# EAGLE design Gyrocam Servo Driver STM32G070KBT6 (EAGLE 9.6.2)
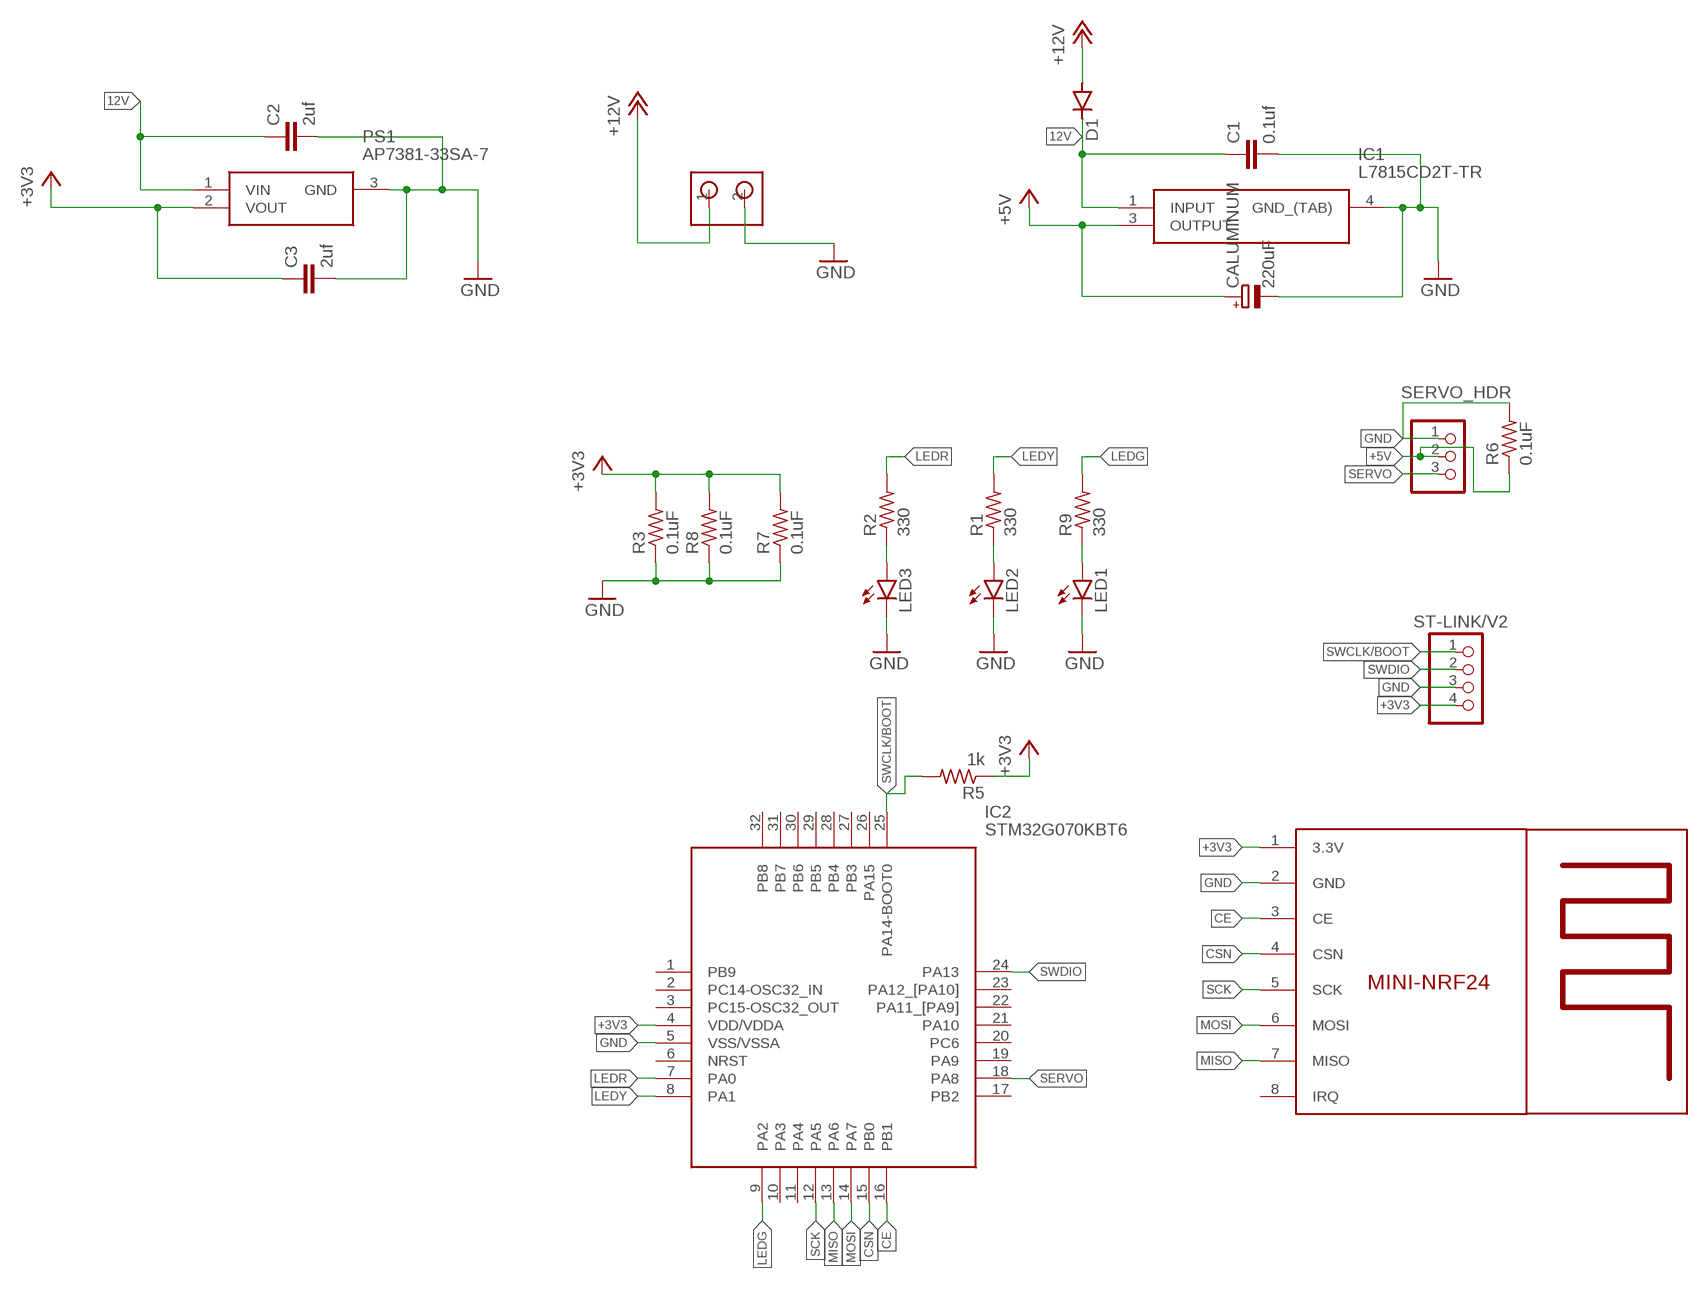
[diagram p0: schematic, sheet 1]

## Parts
C1  0.1uf  C-EUC0805K  [C0805K]
C2  2uf  C-EUC0805K  [C0805K]
C3  2uf  C-EUC0805K  [C0805K]
CALUMINUM  220uF  CPOL-EU153CLV-0810  [153CLV-0810]
D1  DIODE-DO-214AC  [DO-214AC]
IC1  L7815CD2T-TR  [TO254P1542X460-3N]
IC2  STM32G070KBT6  [QFP80P900X900X160-32N]
LED1  LEDSML0805  [SML0805]
LED2  LEDSML0805  [SML0805]
LED3  LEDSML0805  [SML0805]
PS1  AP7381-33SA-7  [SOT96P240X120-3N]
R1  330  R-US_R0805  [R0805]
R2  330  R-US_R0805  [R0805]
R3  0.1uF  R-US_R0805  [R0805]
R5  1k  R-US_R0805  [R0805]
R6  0.1uF  R-US_R0805  [R0805]
R7  0.1uF  R-US_R0805  [R0805]
R8  0.1uF  R-US_R0805  [R0805]
R9  330  R-US_R0805  [R0805]
SERVO_HDR  PINHD-1X3  [1X03]
ST-LINK/V2  PINHD-1X4  [1X04]
U$2  MINI-NRF24L01PSMD  [NRF24L01_SMD]
U$5  PINHEAD2_18AAWG  [PINHEAD2_18AWG]

## Nets
12V: C1.1 C2.1 D1.C IC1.1(INPUT) PS1.1(VIN)
+3V3: C3.1 IC2.4(VDD/VDDA) PS1.2(VOUT) R3.2 R5.1 R7.2 R8.2 ST-LINK/V2.4 U$2.1(3.3V)
+5V: CALUMINUM.+ IC1.3(OUTPUT) R6.1 SERVO_HDR.2
+12V: D1.A U$5.1
CE: IC2.16(PB1) U$2.3(CE)
CSN: IC2.15(PB0) U$2.4(CSN)
GND: C1.2 C2.2 C3.2 CALUMINUM.- IC1.4(GND_(TAB)) IC2.5(VSS/VSSA) LED1.C LED2.C LED3.C PS1.3(GND) R3.1 R6.2 R7.1 R8.1 SERVO_HDR.1 ST-LINK/V2.3 U$2.2(GND) U$5.2
LEDG: IC2.9(PA2) R9.2
LEDR: IC2.7(PA0) R2.2
LEDY: IC2.8(PA1) R1.2
MISO: IC2.13(PA6) U$2.7(MISO)
MOSI: IC2.14(PA7) U$2.6(MOSI)
N$1: LED2.A R1.1
N$2: LED3.A R2.1
N$3: LED1.A R9.1
SCK: IC2.12(PA5) U$2.5(SCK)
SERVO: IC2.18(PA8) SERVO_HDR.3
SWCLK/BOOT: IC2.25(PA14-BOOT0) R5.2 ST-LINK/V2.1
SWDIO: IC2.24(PA13) ST-LINK/V2.2
Unconnected: IC2.1(PB9) IC2.2(PC14-OSC32_IN) IC2.3(PC15-OSC32_OUT) IC2.6(NRST) IC2.10(PA3) IC2.11(PA4) IC2.17(PB2) IC2.19(PA9) IC2.20(PC6) IC2.21(PA10) IC2.22(PA11_[PA9]) IC2.23(PA12_[PA10]) IC2.26(PA15) IC2.27(PB3) IC2.28(PB4) IC2.29(PB5) IC2.30(PB6) IC2.31(PB7) IC2.32(PB8) U$2.8(IRQ)

## Library data of the parts
C1-C3 = rcl:C-EU: CAPACITOR, European symbol; SPICEPREFIX: C
CALUMINUM = rcl:CPOL-EU: POLARIZED CAPACITOR, European symbol; SPICEPREFIX: C
D1 = diode:DIODE-: DIODE
IC1 = 6voltsL7815CD2T-TR:L7815CD2T-TR: Voltage Regulator 15V 1.5A D2PAK STMicroelectronics L7815CD2T-TR, Single Linear Voltage Regulator, 1.5A 15 V, 3-Pin D2PAK Source: Datasheet <http://www.st.com/web/en/resource/technical/document/datasheet/CD00000444.pdf>; DESCRIPTION: Voltage Regulator 15V 1.5A D2PAK STMicroelectronics L7815CD2T-TR, Single Linear Voltage Regulator, 1.5A 15 V, 3-Pin D2PAK; HEIGHT: 4.6mm; MANUFACTURER_NAME: STMicroelectronics; MANUFACTURER_PART_NUMBER: L7815CD2T-TR; MOUSER_PART_NUMBER: 511-L7815CD2T-TR; MOUSER_PRICE-STOCK: https://www.mouser.co.uk/ProductDetail/STMicroelectronics/L7815CD2T-TR?qs=UnsPL7ngM55qtUyn38JDrw%3D%3D
IC2 = mouser-STM32G070KBT6:STM32G070KBT6: 32-bit Microcontrollers - MCU Arm Cortex -M0+ 32-bit MCU, 128 KB Flash, 36 KB RAM, 4x USART, timers, ADC, comm. I/Fs, 2.0-3.6V Source: Datasheet; DESCRIPTION: 32-bit Microcontrollers - MCU Arm Cortex -M0+ 32-bit MCU, 128 KB Flash, 36 KB RAM, 4x USART, timers, ADC, comm. I/Fs, 2.0-3.6V; HEIGHT: 1.6mm; MANUFACTURER_NAME: STMicroelectronics; MANUFACTURER_PART_NUMBER: STM32G070KBT6; MOUSER_PART_NUMBER: 511-STM32G070KBT6; MOUSER_PRICE-STOCK: https://www.mouser.co.uk/ProductDetail/STMicroelectronics/STM32G070KBT6?qs=l7cgNqFNU1hmGcXjKEot4A%3D%3D
LED1-LED3 = led:LED: LED OSRAM: - CHIPLED LG R971, LG N971, LY N971, LG Q971, LY Q971, LO R971, LY R971 LH N974, LH R974 LS Q976, LO Q976, LY Q976 LO Q996 - Hyper CHIPLED LW Q18S LB Q993, LB Q99A, LB R99A - SideLED LS A670, LO A670, LY A670, LG A670, LP A670 LB A673, LV A673, LT A673, LW A673 LH A674 LY A675 LS A676, LA A676, LO A676, LY A676, LW A676 LS A679, LY A679, LG A679 - Hyper Micro SIDELED® LS Y876, LA Y876, LO Y876, LY Y876 LT Y87S - SmartLED LW L88C, LW L88S LB L89C, LB L89S, LG L890 LS L89K, LO L89K, LY L89K LS L896, LA L896, LO L896, LY L896 - TOPLED LS T670, LO T670, LY T670, LG T670, LP T670 LSG T670, LSP T670, LSY T670, LOP T670, LYG T670 LG T671, LOG T671, LSG T671 LB T673, LV T673, LT T673, LW T673 LH T674 LS T676, LA T676, LO T676, LY T676, LB T676, LH T676, LSB T676, LW T676 LB T67C, LV T67C, LT T67C, LS T67K, LO T67K, LY T67K, LW E67C LS E67B, LA E67B, LO E67B, LY E67B, LB E67C, LV E67C, LT E67C LW T67C LS T679, LY T679, LG T679 LS T770, LO T770, LY T770, LG T770, LP T770 LB T773, LV T773, LT T773, LW T773 LH T774 LS E675, LA E675, LY E675, LS T675 LS T776, LA T776, LO T776, LY T776, LB T776 LHGB T686 LT T68C, LB T68C - Hyper Mini TOPLED® LB M676 - Mini TOPLED Santana® LG M470 LS M47K, LO M47K, LY M47K Source: http://www.osram.convergy.de LUXEON: - LUMILED® LXK2-PW12-R00, LXK2-PW12-S00, LXK2-PW14-U00, LXK2-PW14-V00 LXK2-PM12-R00, LXK2-PM12-S00, LXK2-PM14-U00 LXK2-PE12-Q00, LXK2-PE12-R00, LXK2-PE12-S00, LXK2-PE14-T00, LXK2-PE14-U00 LXK2-PB12-K00, LXK2-PB12-L00, LXK2-PB12-M00, LXK2-PB14-N00, LXK2-PB14-P00, LXK2-PB14-Q00 LXK2-PR12-L00, LXK2-PR12-M00, LXK2-PR14-Q00, LXK2-PR14-R00 LXK2-PD12-Q00, LXK2-PD12-R00, LXK2-PD12-S00 LXK2-PH12-R00, LXK2-PH12-S00 LXK2-PL12-P00, LXK2-PL12-Q00, LXK2-PL12-R00 Source: www.luxeon.com KINGBRIGHT: KA-3528ASYC Source: www.kingbright.com
PS1 = 3.3v_AP7381-33SA-7:AP7381-33SA-7: LDO CMOS LowCurr SOT23 T&R 3K Source: Datasheet <https://www.diodes.com/assets/Datasheets/AP7381.pdf>; DESCRIPTION: LDO CMOS LowCurr SOT23 T&R 3K; HEIGHT: 1.2mm; MANUFACTURER_NAME: Diodes Inc.; MANUFACTURER_PART_NUMBER: AP7381-33SA-7; MOUSER_PART_NUMBER: 621-AP7381-33SA-7; MOUSER_PRICE-STOCK: https://www.mouser.co.uk/ProductDetail/Diodes-Incorporated/AP7381-33SA-7?qs=y6ZabgHbY%252ByfboEZm%252BnPlA%3D%3D
R1-R3 R5-R9 = rcl:R-US_: RESISTOR, American symbol; SPICEPREFIX: R
SERVO_HDR = pinhead:PINHD-1X3: PIN HEADER
ST-LINK/V2 = pinhead:PINHD-1X4: PIN HEADER
U$2 = Gil:MINI-NRF24L01P
U$5 = Gil:PINHEAD2_18AAWG

## Board
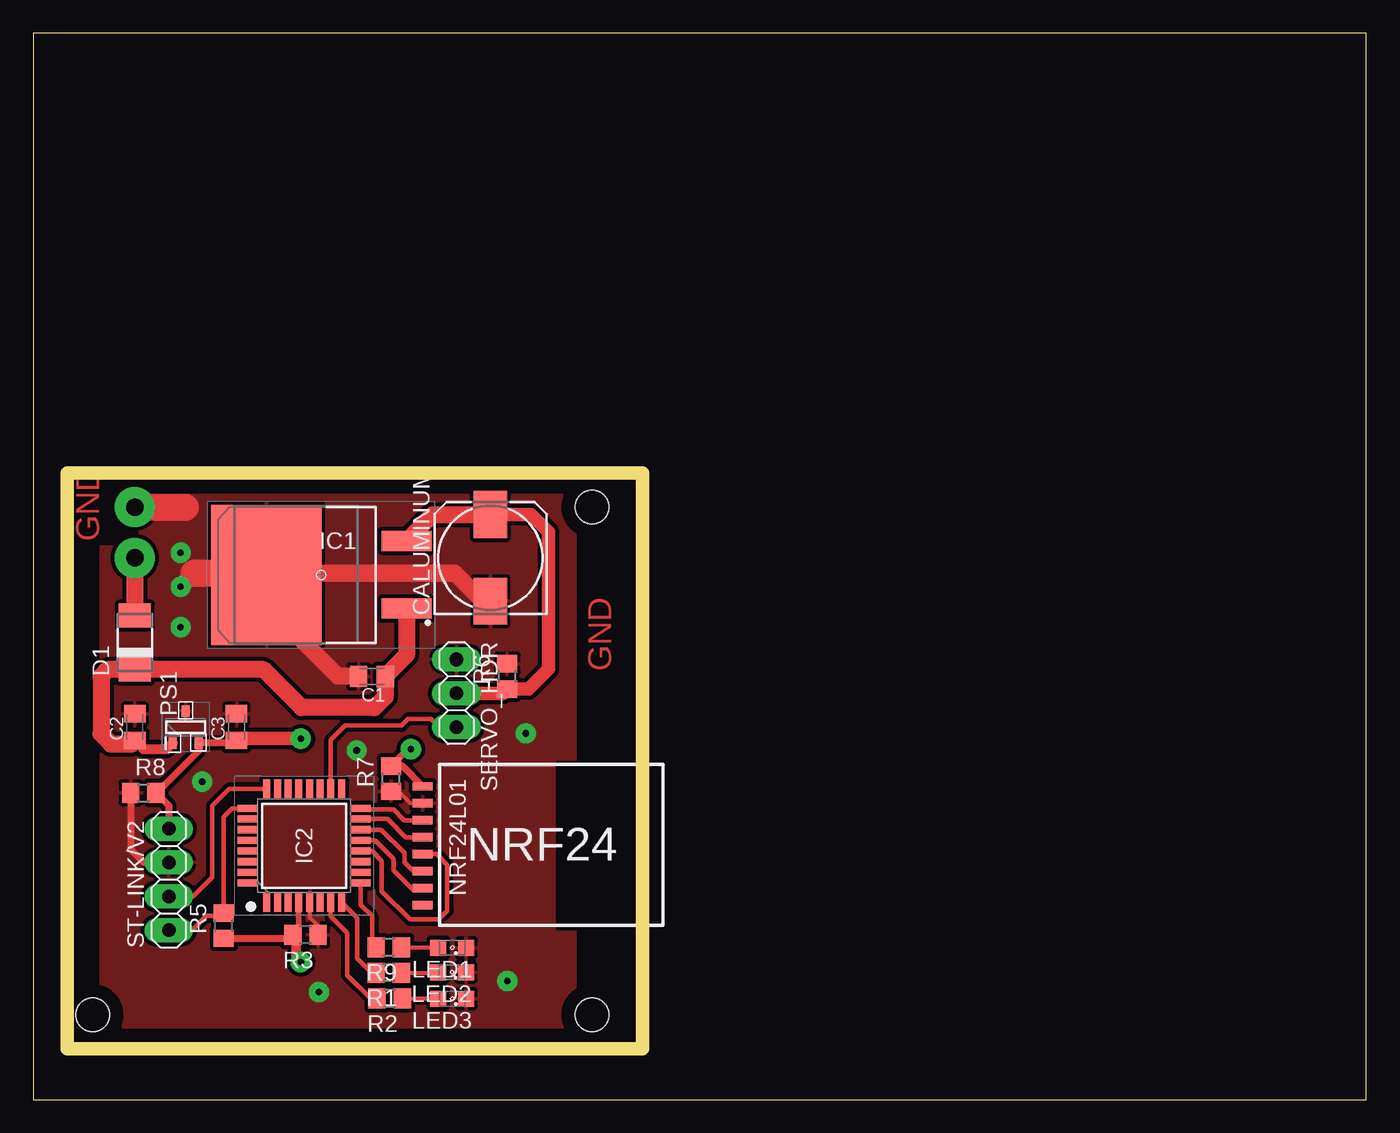
[diagram p1: board, top side]
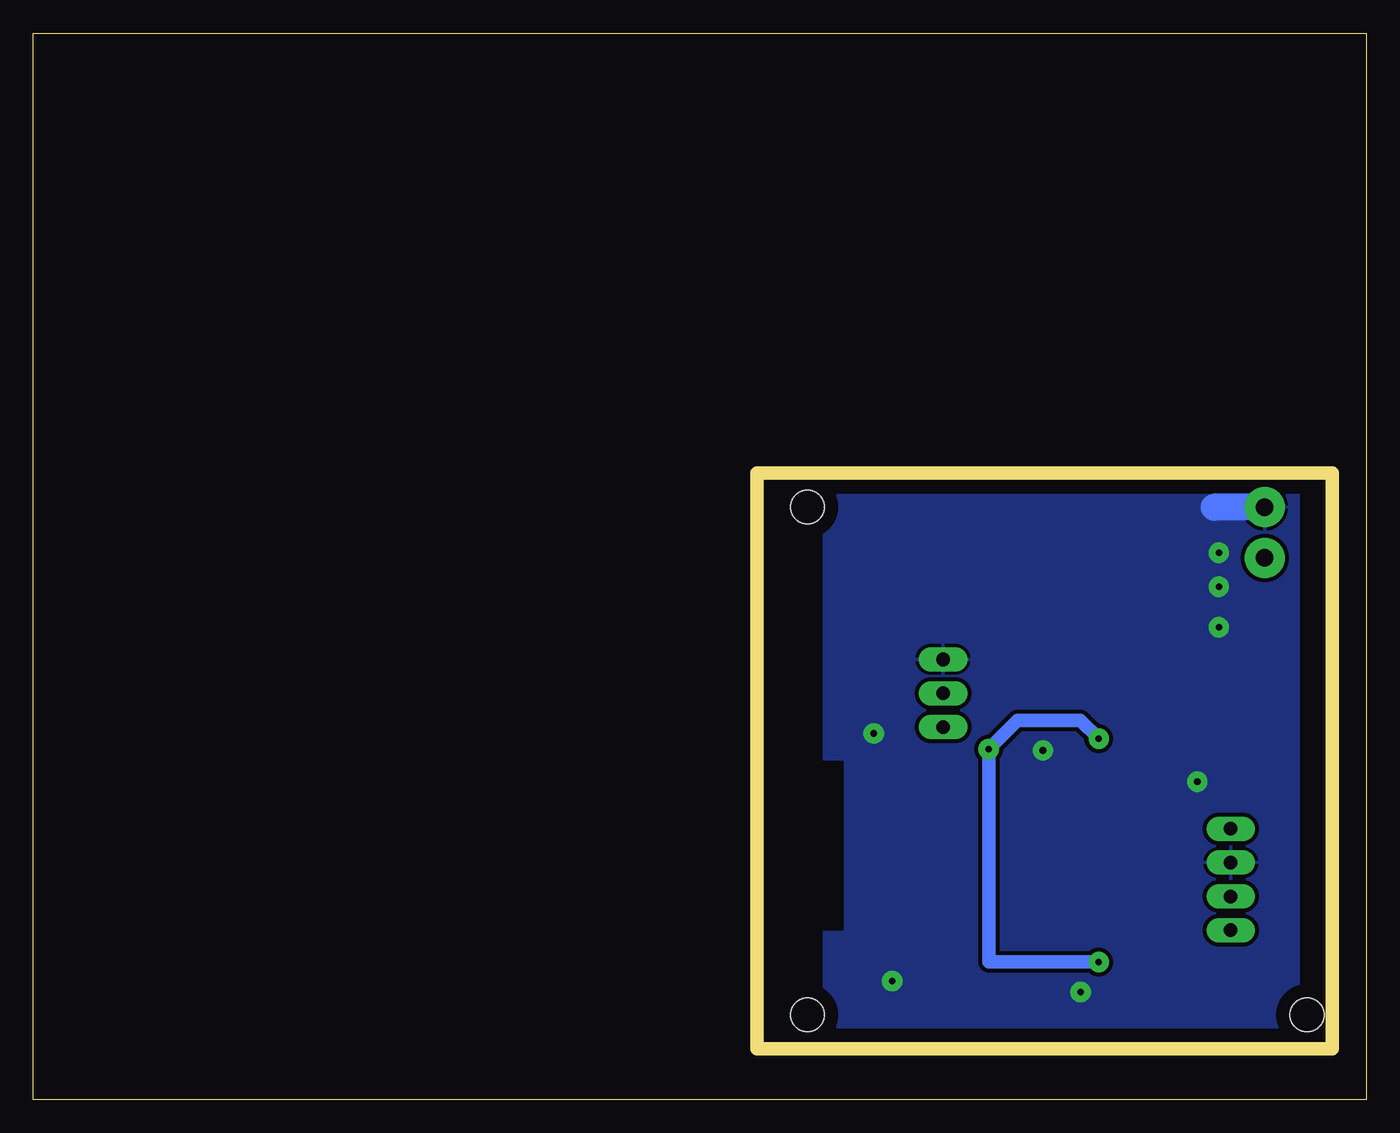
[diagram p2: board, bottom side, seen from below]

Size 100 x 80 mm. Coordinates in mm from the lower left corner, seen from the top.
Outline: 0,0 100,0 100,80 0,80 0,0
Outline: 2.54,46.99 2.54,3.81 45.72,3.81 45.72,46.99 2.54,46.99
Copper layers (1*16): Top 0.035mm / dielectric 1.5mm / Bottom 0.035mm
Design rules "default *": minimum track width 6mil, minimum drill 0.35mm, track to track 12mil, track to pad 12mil, pad to pad 12mil, via to via 12mil, smd to smd 6mil, copper to edge 40mil, drill to drill 6mil, minimum pad ring 16mil, minimum via ring 20mil, stop-mask expansion 4mil, vias tented up to drill 0mil, thermal gap 10mil
Holes 2.54 mm at 41.91,44.45 41.91,6.35 4.45,6.35
Milling: 4 lines

### Footprints (pad centres in the part's own frame; a part is rotated, then mirrored left to right if it is on the bottom)
C0805K = smd 1.3 x 1.6: 1 -1,0; 2 1,0
153CLV-0810 = smd 3.5 x 2.5: + 3.25,0; - -3.25,0
DO-214AC = smd 1.8 x 2.4: A 2.025,0; C -2.025,0
TO254P1542X460-3N = smd 3.75 x 1.5: 1 -6.4,2.54; 3 -6.4,-2.54 | smd 8.3 x 10.5: 4 4.1,0
QFP80P900X900X160-32N = smd 1.475 x 0.533: 1 -4.238,2.8; 2 -4.238,2; 3 -4.238,1.2; 4 -4.238,0.4; 5 -4.238,-0.4; 6 -4.238,-1.2; 7 -4.238,-2; 8 -4.238,-2.8; 17 4.238,-2.8; 18 4.238,-2; 19 4.238,-1.2; 20 4.238,-0.4; 21 4.238,0.4; 22 4.238,1.2; 23 4.238,2; 24 4.238,2.8 | smd 0.533 x 1.475: 9 -2.8,-4.238; 10 -2,-4.238; 11 -1.2,-4.238; 12 -0.4,-4.238; 13 0.4,-4.238; 14 1.2,-4.238; 15 2,-4.238; 16 2.8,-4.238; 25 2.8,4.238; 26 2,4.238; 27 1.2,4.238; 28 0.4,4.238; 29 -0.4,4.238; 30 -1.2,4.238; 31 -2,4.238; 32 -2.8,4.238
SML0805 = smd 1.2 x 1.2: A 1.05,0; C -1.05,0
SOT96P240X120-3N = smd 0.85 x 0.6: 1 -1.2,0.96; 2 -1.2,-0.96; 3 1.2,0
R0805 = smd 1.3 x 1.5: 1 -0.95,0; 2 0.95,0
1X03 = drill 1.016 long: 1 -2.54,0; 2 0,0; 3 2.54,0
1X04 = drill 1.016 long: 1 -3.81,0; 2 -1.27,0; 3 1.27,0; 4 3.81,0
NRF24L01_SMD = smd 1.5 x 0.635: 1 0,4.445; 2 0,3.175; 3 0,1.905; 4 0,0.635; 5 0,-0.635; 6 0,-1.905; 7 0,-3.175; 8 0,-4.445
PINHEAD2_18AWG = drill 1.3 pad 3: 1 0,1.27; 2 0,-2.54

### Placement (x,y rotation side)
C1  25.4,31.75 180 top
C2  7.62,27.94 90 top
C3  15.24,27.94 90 top
CALUMINUM  34.29,40.64 90 top
D1  7.62,34.29 90 top
IC1  21.59,39.37 180 top
IC2  20.32,19.05 90 top
LED1  31.43,11.4 180 top
LED2  31.4,9.56 180 top
LED3  31.43,7.56 180 top
PS1  11.43,27.94 90 top
R1  26.67,9.53 180 top
R2  26.73,7.59 180 top
R3  20.42,12.35 180 top
R5  14.29,13.05 90 top
R6  35.56,31.75 90 top
R7  26.83,24.07 90 top
R8  8.26,23.02 0 top
R9  26.67,11.43 180 top
SERVO_HDR  31.75,30.48 270 top
ST-LINK/V2  10.16,16.51 90 top
U$2  29.21,19.05 0 top
U$5  7.62,41.91 180 top

### Tracks (layer width: path | path; a pad name or v marks a point on that pad's centre or on a via)
12V
  Top 0.762: C2.1 8.27,26.29 10.02,26.29 PS1.1
  Top 1.27: C2.1 7.35,26.67 5.84,26.67 5.08,27.43 5.08,31.75 5.59,32.27 D1.C 17.27,32.27 20.13,29.4 25.59,29.4 26.4,30.21 C1.1 27.99,33.34 IC1.1
+3V3  (via drill 0.5)
  Top 0.305: 19.92,12.81 R3.2
  Top 0.406: IC2.4 19.92,12.81
  Top 0.508: C3.1 15.04,26.74 PS1.2 12.39,26.17 9.85,23.62 R8.2 10.16,22.06 ST-LINK/V2.4 | R3.2 19.46,11.94 19.81,11.59 19.81,10.57 v20.07,10.32 19.59,10.79 19.59,12.1 R5.1 | v28.32,26.29 28.1,26.29 R7.2 27.69,25.02 U$2.1
  Top 1.016: v20.07,27.08 15.38,27.08 C3.1
  Bottom 1.016: v20.07,27.08 21.43,28.45 26.16,28.45 v28.32,26.29 28.32,10.32 v20.07,10.32
+5V
  Top 1.016: CALUMINUM.+ 37.33,43.89 38.64,42.58 38.64,32.29 37.15,30.8 R6.1 35.24,30.48 SERVO_HDR.2
  Top 1.27: IC1.3 29.97,43.89 CALUMINUM.+ 34.85,43.89
+12V
  Top 1.27: U$5.1 D1.A
CE
  Top 0.305: IC2.16 24.65,21.75
  Top 0.356: 24.65,21.75 27.01,21.75 27.81,20.95 U$2.3
CSN
  Top 0.356: IC2.15 26.57,21.05 27.94,19.68 U$2.4
GND  (via drill 0.5, 0.5 pad 1.07)
  Top 0.305: IC2.5 20.72,13.66 21.36,13.02 R3.1 | U$2.2 28.29,22.23 27.4,23.12 R7.1
  Top 0.508: R8.1 7.3,18.76 8.29,17.78 ST-LINK/V2.3
  Top 1.27: v11.05,38.48 12.05,39.48 | C1.2 22.86,31.75 17.49,37.12 IC1.4 17.38,39.48 31.64,39.48 33.73,37.39 CALUMINUM.-
  Top 2.032: 17.38,39.48 12.05,39.48 | U$5.2 11.43,44.45
  Bottom 2.032: U$5.2 11.43,44.45
  other vias: 11.05,35.43 35.56,8.89 24.26,26.19 21.43,8.06 12.67,23.84 11.05,41.02 36.96,27.46
  pour Top: 5.08,45.72 40.64,45.72 40.64,5.08 5.08,5.08
  pour Bottom: 5.08,45.72 40.64,45.72 40.64,5.08 5.08,5.08
LEDG
  Top 0.356: IC2.9 24.56,14.62 25.4,13.78 25.4,11.75 R9.2
LEDR
  Top 0.305: IC2.7 22.4,14.74
  Top 0.356: IC2.7 22.32,13.75 23.56,12.51 23.56,9.34 25.3,7.59 R2.2
LEDY
  Top 0.356: IC2.8 24.29,13.64 24.29,10.6 25.37,9.53 R1.2
MISO
  Top 0.305: U$2.7 29.07,15.73 28.49,15.73
  Top 0.356: IC2.13 25.64,19.45 27.01,18.07 27.01,17.21 28.49,15.73
MOSI
  Top 0.356: IC2.14 26.11,20.25 27.84,18.51 27.84,17.78 28.48,17.14 U$2.6
N$1
  Top 0.305: R1.1 30.32,9.53 LED2.A
N$2
  Top 0.305: R2.1 30.35,7.59 LED3.A
N$3
  Top 0.305: R9.1 30.35,11.43 LED1.A
SCK
  Top 0.305: U$2.5 29.22,18.43
  Top 0.356: IC2.12 25.41,18.65 26.15,17.91 26.15,15.63 28.27,13.51 30.4,13.51 31.05,14.16 31.05,17.62 30.25,18.43 29.22,18.43
SERVO
  Top 0.356: IC2.18 22.32,26.99 23.4,28.07 27.62,28.07 28.13,28.57 29.84,28.57 30.48,27.94 SERVO_HDR.3
SWCLK/BOOT
  Top 0.305: R5.2 14.07,13.78
  Top 0.356: IC2.25 14.93,21.85 14.29,21.21 R5.2 | 14.07,13.78 12.99,13.78 11.91,12.7 ST-LINK/V2.1
SWDIO
  Top 0.356: IC2.24 14.68,23.29 13.43,22.04 13.43,16.67 12,15.24 ST-LINK/V2.2

### Text on the board
Top: GND | GND